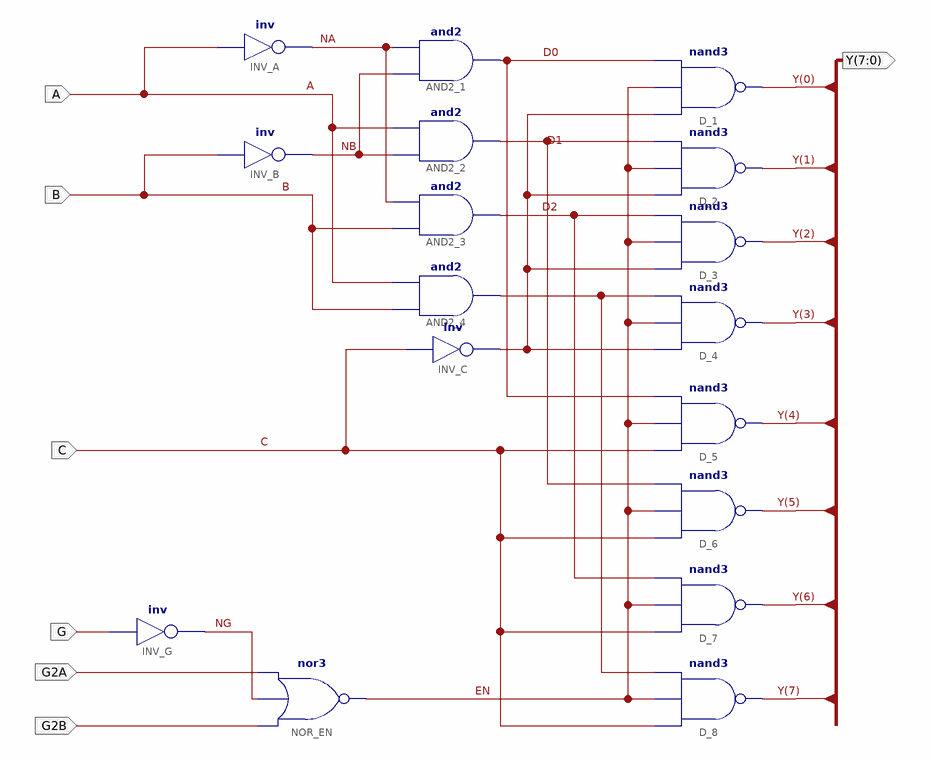
[diagram p0: schematic sheet 1]
// Xilinx ISE schematic D_74LS138.sch (kintex7) as structural Verilog: 17 symbols, 7 ports
module D_74LS138 (
  input  A,
  input  B,
  input  C,
  input  G,
  input  G2A,
  input  G2B,
  output [7:0] Y
);

  wire D0, D1, D2, D3, EN, NA, NB, NG, XLXN_67;

  not INV_A (NA, A);
  not INV_B (NB, B);
  not INV_G (NG, G);
  not INV_C (XLXN_67, C);
  and AND2_1 (D0, NB, NA);
  and AND2_2 (D1, NB, A);
  and AND2_3 (D2, B, NA);
  and AND2_4 (D3, B, A);
  nand D_1 (Y[0], XLXN_67, EN, D0);
  nand D_2 (Y[1], XLXN_67, EN, D1);
  nand D_3 (Y[2], XLXN_67, EN, D2);
  nand D_4 (Y[3], XLXN_67, EN, D3);
  nand D_5 (Y[4], C, EN, D0);
  nand D_6 (Y[5], C, EN, D1);
  nand D_7 (Y[6], C, EN, D2);
  nand D_8 (Y[7], C, EN, D3);
  nor NOR_EN (EN, G2B, NG, G2A);
endmodule
